# EAGLE schematic APRS_Pico_with_Baofeng_UV-5R (EAGLE 9.6.1)
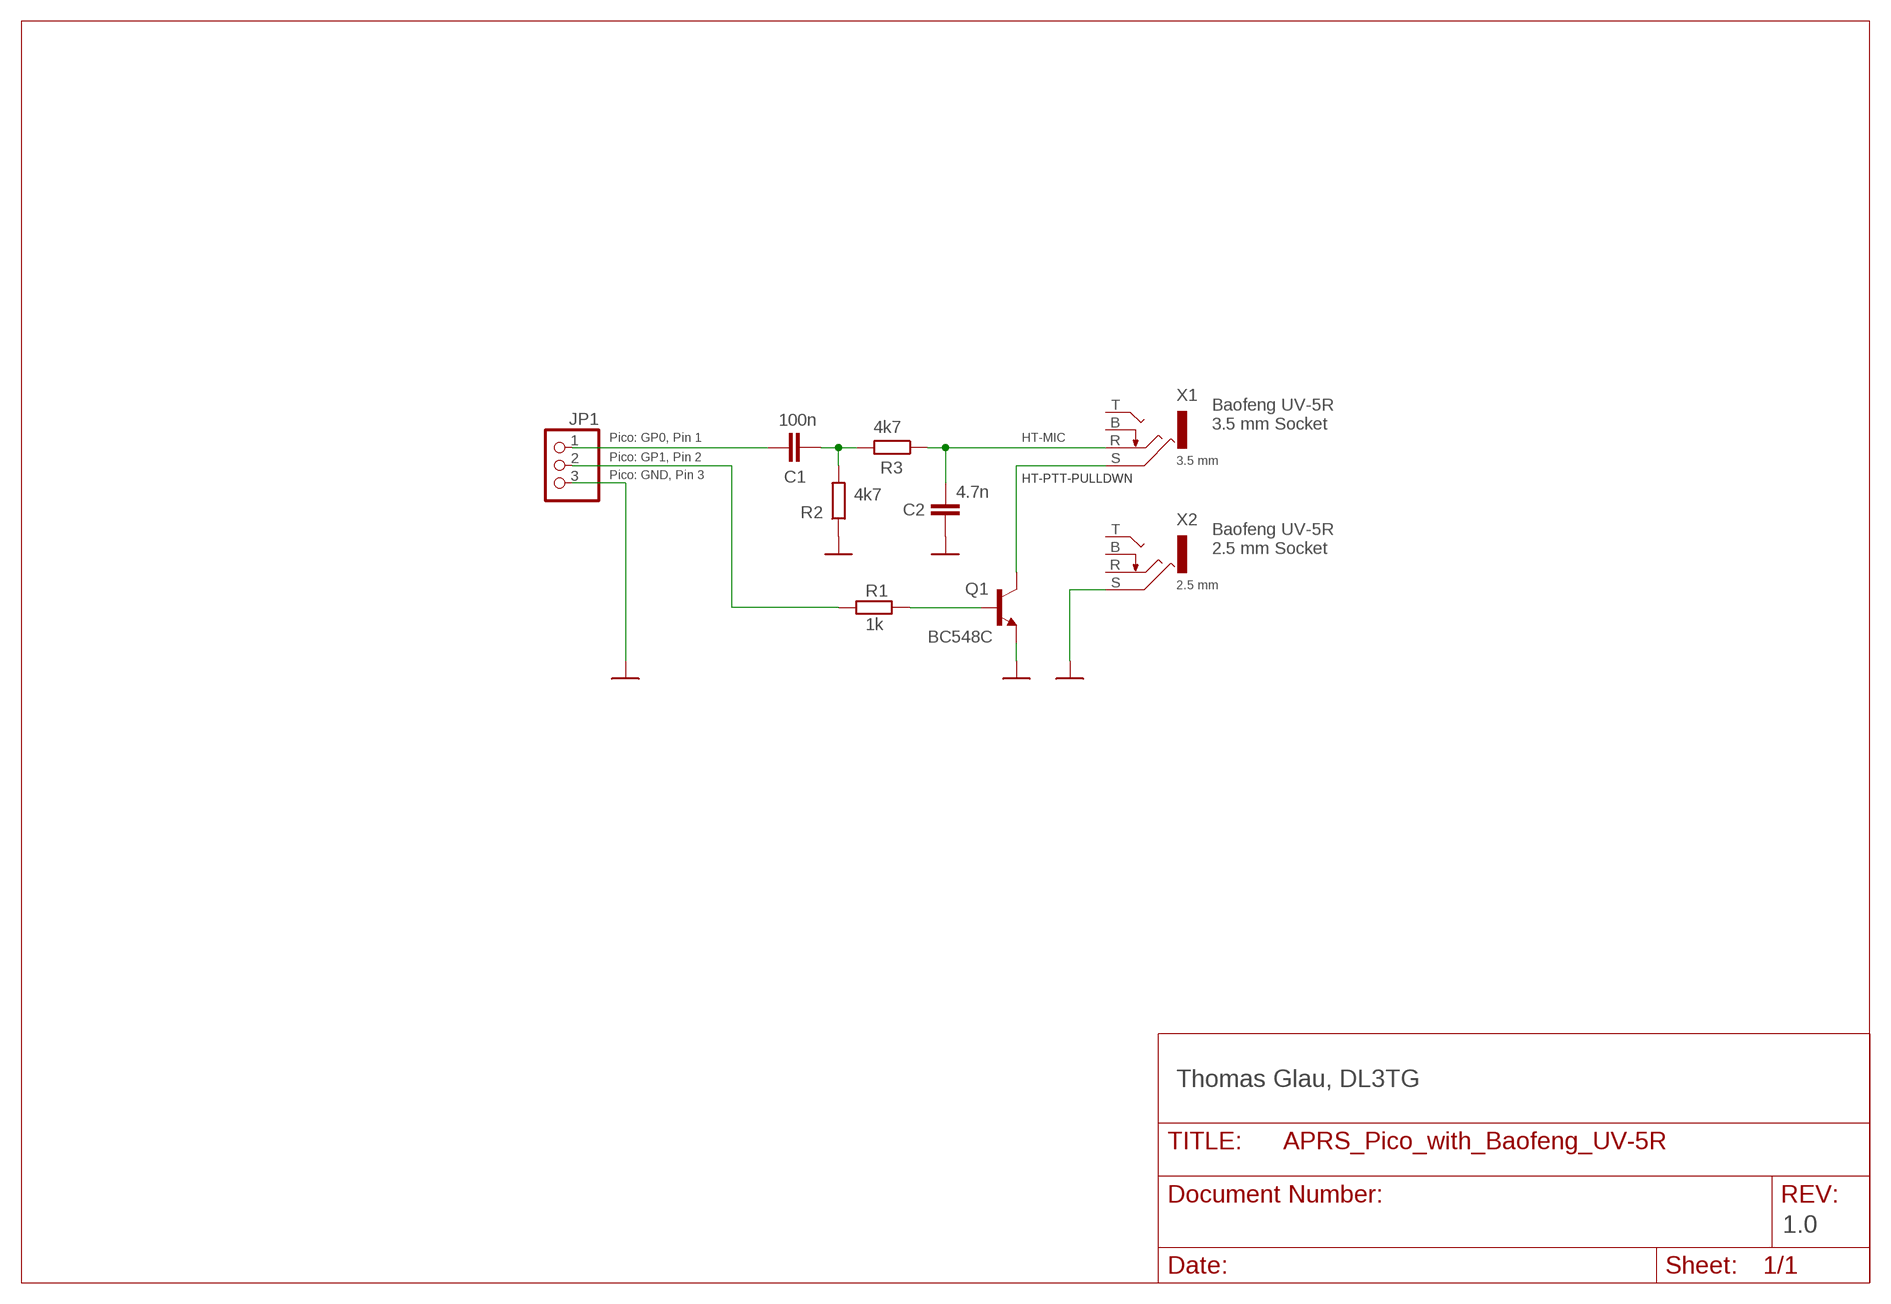
[diagram p0: schematic, sheet 1]

## Parts
C1  100n  C  [C0805]
C2  4.7n  C  [C0805]
JP1  PINHD-1X3  [1X03]
Q1  BC548C  BC548  [TO92-EBC]
R1  1k  R-EU_0207/10  [0207/10]
R2  4k7  R  [R0805]
R3  4k7  R  [R0805]
X1  KLBR4  [KLBR4]
X2  KLBR4  [KLBR4]

## Nets
GND: C2.1 JP1.3 Q1.E R2.1 X2.S
GP0: C1.1 JP1.1
HT-PTT-PULLDWN: Q1.C X1.S
LINE-OUT: C2.2 R3.1 X1.R
N$1: JP1.2 R1.1
N$2: C1.2 R2.2 R3.2
N$3: Q1.B R1.2
Unconnected: X1.B X1.T X2.B X2.R X2.T

## Notes on the sheet
- Baofeng UV-5R
  3.5 mm Socket
- Pico: GP0, Pin 1 | HT-MIC
- Pico: GP1, Pin 2 | 3.5 mm
- Pico: GND, Pin 3
- Baofeng UV-5R
  2.5 mm Socket
- 2.5 mm
- Thomas Glau, DL3TG
- 1.0

## Library data of the parts
C1 C2 = eagle-ltspice:C: CAPACITOR, European symbol; SPICEMODEL: NONE; SPICEPREFIX: C
JP1 = pinhead:PINHD-1X3: PIN HEADER
Q1 = transistor-npn:BC548*: NPN Transistor
R1 = rcl:R-EU_: RESISTOR, European symbol; SPICEPREFIX: R
R2 R3 = eagle-ltspice:R: RESISTOR, European symbol; SPICEMODEL: NONE; SPICEPREFIX: R
X1 X2 = con-lumberg:KLBR4: Jack connectors according to JISC 6560, 3.5 mm Klinkeneinbaukupplung nach JISC 6560, 3,5 mm, 3-polig/ stereo, abgewinkelte Ausführung, mit Öffner, für Leiterplatten Source: Data sheet <http://www.lumberg.com/Produkte/PDFs/KLBR4.pdf>; MPN: KLBR 4; OC_FARNELL: 1217016; OC_NEWARK: 97K2709